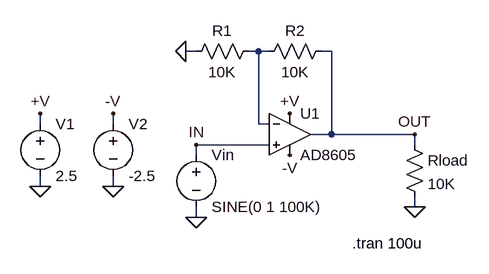
[diagram p0: schematic AD8605.asc]
AD8605.asc, the LTspice schematic file:
Version 4
SHEET 1 1240 700
WIRE 464 -1168 448 -1168
WIRE 560 -1168 544 -1168
WIRE 576 -1168 560 -1168
WIRE 672 -1168 656 -1168
WIRE 224 -1056 224 -1072
WIRE 336 -1056 336 -1072
WIRE 560 -1056 560 -1168
WIRE 576 -1056 560 -1056
WIRE 672 -1040 672 -1168
WIRE 672 -1040 640 -1040
WIRE 800 -1040 672 -1040
WIRE 576 -1024 464 -1024
WIRE 800 -1024 800 -1040
WIRE 464 -1008 464 -1024
WIRE 224 -960 224 -976
WIRE 336 -960 336 -976
WIRE 800 -928 800 -944
WIRE 464 -912 464 -928
FLAG 224 -1072 +V
FLAG 224 -960 0
FLAG 464 -912 0
FLAG 800 -1040 OUT
FLAG 464 -1024 IN
FLAG 608 -1072 +V
FLAG 336 -1072 -V
FLAG 608 -1008 -V
FLAG 448 -1168 0
FLAG 800 -928 0
FLAG 336 -960 0
SYMBOL voltage 464 -1024 R0
WINDOW 123 24 146 Left 2
WINDOW 39 24 125 Left 2
SYMATTR InstName Vin
SYMATTR Value SINE(0 1 100K)
SYMBOL Opamps\\AD8605 608 -1104 R0
SYMATTR InstName U1
SYMBOL voltage 224 -1072 R0
WINDOW 123 0 0 Left 2
WINDOW 39 0 0 Left 2
SYMATTR InstName V1
SYMATTR Value 2.5
SYMBOL res 560 -1184 R90
WINDOW 0 0 56 VBottom 2
WINDOW 3 32 56 VTop 2
SYMATTR InstName R1
SYMATTR Value 10K
SYMBOL res 672 -1184 R90
WINDOW 0 0 56 VBottom 2
WINDOW 3 32 56 VTop 2
SYMATTR InstName R2
SYMATTR Value 10K
SYMBOL voltage 336 -1072 R0
WINDOW 123 24 146 Left 2
WINDOW 39 24 125 Left 2
SYMATTR InstName V2
SYMATTR Value -2.5
SYMBOL res 784 -1040 R0
SYMATTR InstName Rload
SYMATTR Value 10K
TEXT 704 -872 Left 2 !.tran 100u

The netlist it stands for:
* AD8605.asc
Vin IN 0 SINE(0 1 100K)
XU1 IN N001 +V -V OUT AD8605  ; pins In+ In- V+ V- OUT
V1 +V 0 2.5
R1 N001 0 10K
R2 OUT N001 10K
V2 -V 0 -2.5
Rload OUT 0 10K
.tran 100u
.lib ADI.lib
.backanno
.end